# EAGLE schematic shield (EAGLE 6.5.0)
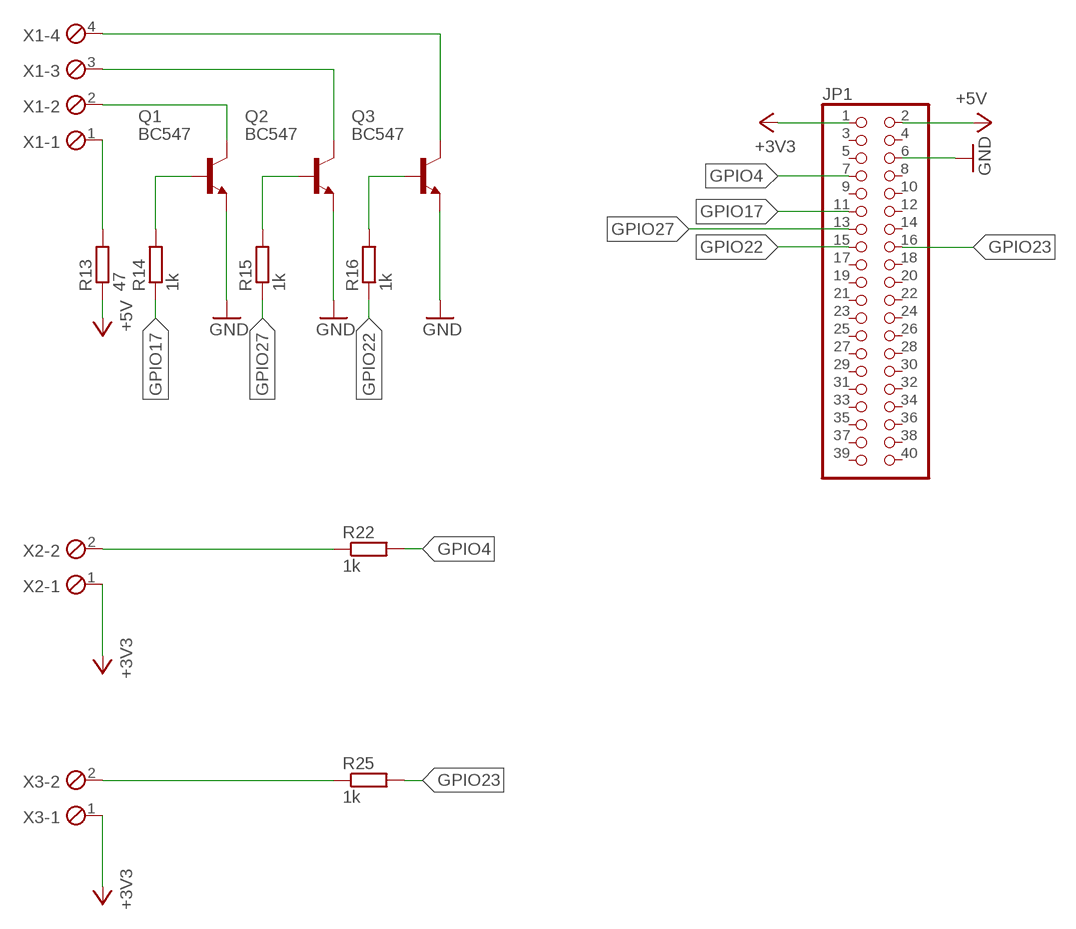
[diagram p0: schematic, sheet 1]

## Parts
JP1  PINHD-2X20  [2X20]
Q1  BC547  [TO92]
Q2  BC547  [TO92]
Q3  BC547  [TO92]
R13  47  R-EU_0204/7  [0204/7]
R14  1k  R-EU_0204/5  [0204/5]
R15  1k  R-EU_0204/7  [0204/7]
R16  1k  R-EU_0204/7  [0204/7]
R22  1k  R-EU_0204/7  [0204/7]
R25  1k  R-EU_0204/7  [0204/7]
X1  MPT4  [4POL254]
X2  MPT2  [2POL254]
X3  MPT2  [2POL254]

## Nets
+3V3: JP1.1 X2.1 X3.1
+5V: JP1.2 R13.1
GND: JP1.6 Q1.1(E) Q2.1(E) Q3.1(E)
GPIO4: JP1.7 R22.2
GPIO17: JP1.11 R14.1
GPIO22: JP1.15 R16.1
GPIO23: JP1.16 R25.2
GPIO27: JP1.13 R15.1
N$1: R25.1 X3.2
N$25: R13.2 X1.1
N$27: Q1.3(C) X1.2
N$28: Q2.3(C) X1.3
N$29: Q3.3(C) X1.4
N$30: Q1.2(B) R14.2
N$31: Q2.2(B) R15.2
N$32: Q3.2(B) R16.2
N$34: R22.1 X2.2
Unconnected: JP1.3 JP1.4 JP1.5 JP1.8 JP1.9 JP1.10 JP1.12 JP1.14 JP1.17 JP1.18 JP1.19 JP1.20 JP1.21 JP1.22 JP1.23 JP1.24 JP1.25 JP1.26 JP1.27 JP1.28 JP1.29 JP1.30 JP1.31 JP1.32 JP1.33 JP1.34 JP1.35 JP1.36 JP1.37 JP1.38 JP1.39 JP1.40

## Library data of the parts
JP1 = pinhead:PINHD-2X20: PIN HEADER
Q1-Q3 = transistor-npn:BC547*: NPN Transistor
R13-R16 R22 R25 = rcl:R-EU_: RESISTOR, European symbol
X1 = con-phoenix-254:MPT4: PHOENIX CONNECTOR; OC_FARNELL: unknown; OC_NEWARK: unknown
X2 X3 = con-phoenix-254:MPT2: PHOENIX CONNECTOR; OC_FARNELL: unknown; OC_NEWARK: unknown